# Altium schematic sheet main.SchDoc
size A4
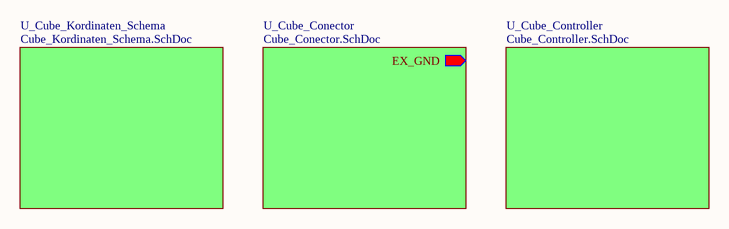
[diagram p0: main.SchDoc]

## Sub-sheets
U_Cube_Conector = Cube_Conector.SchDoc: EX_GND (out)
U_Cube_Controller = Cube_Controller.SchDoc: no entries
U_Cube_Kordinaten_Schema = Cube_Kordinaten_Schema.SchDoc: no entries